# Altium schematic sheet Mosfet Driver.SchDoc
size A
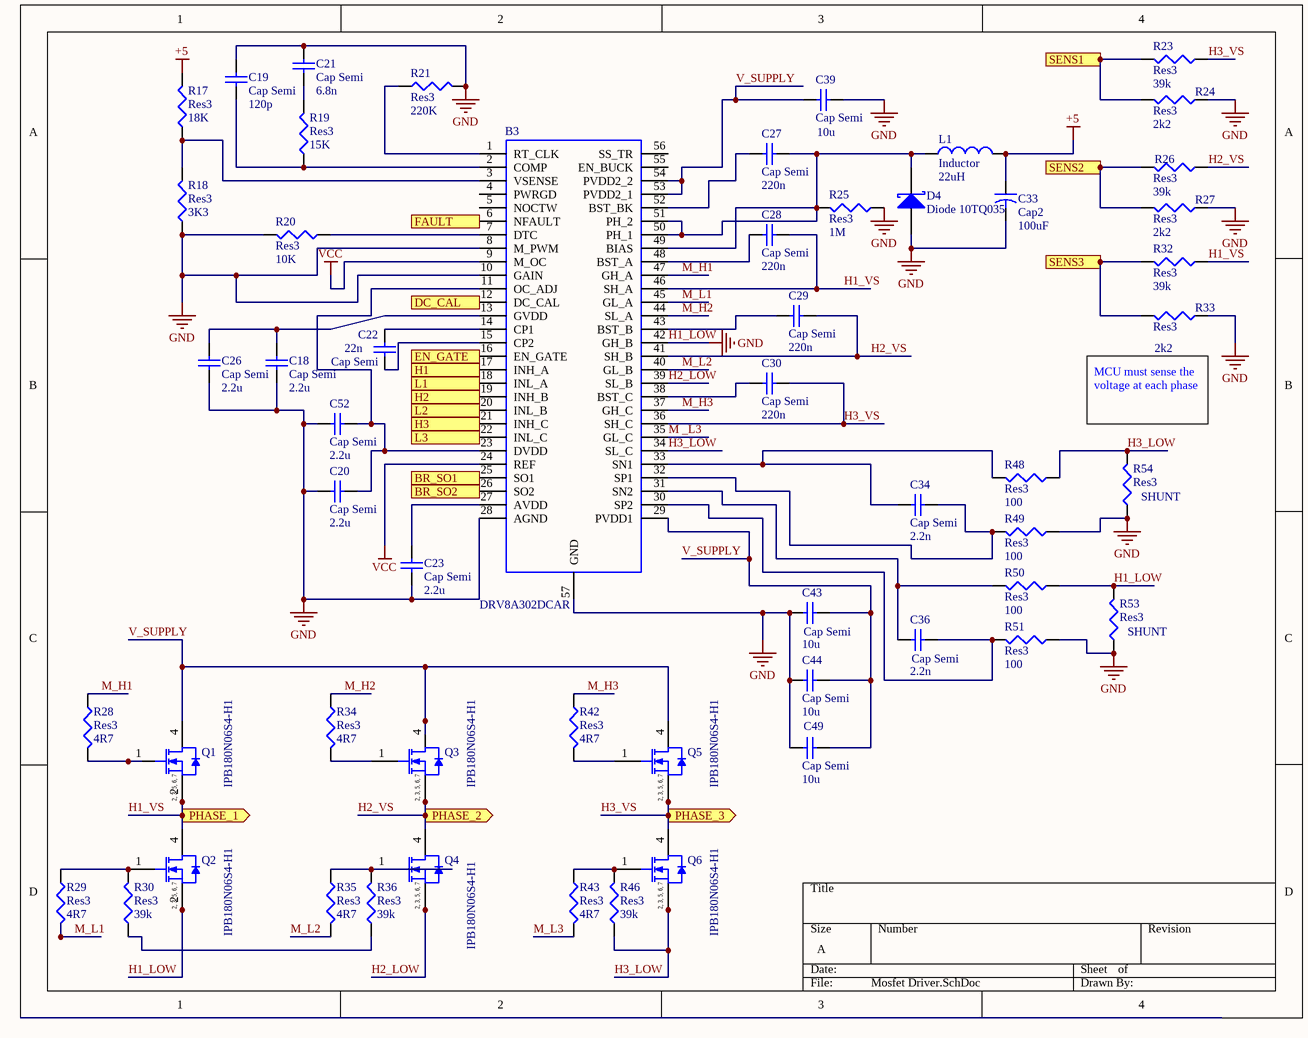
[diagram p0: Mosfet Driver.SchDoc]

## Parts
B3  DRV8A302DCAR  [SOP50P810X120-57N]
C18  Cap Semi  value 2.2u  [1608[0603]]
C19  Cap Semi  value 120p  [1608[0603]]
C20  Cap Semi  value 2.2u  [1608[0603]]
C21  Cap Semi  value 6.8n  [1608[0603]]
C22  Cap Semi  value 22n  [1608[0603]]
C23  Cap Semi  value 2.2u  [1608[0603]]
C26  Cap Semi  value 2.2u  [1608[0603]]
C27  Cap Semi  value 220n  [1608[0603]]
C28  Cap Semi  value 220n  [1608[0603]]
C29  Cap Semi  value 220n  [1608[0603]]
C30  Cap Semi  value 220n  [1608[0603]]
C33  Cap2  value 100uF  [CAPR5-4X5]
C34  Cap Semi  value 2.2n  [1608[0603]]
C36  Cap Semi  value 2.2n  [1608[0603]]
C39  Cap Semi  value 10u  [1608[0603]]
C43  Cap Semi  value 10u  [1608[0603]]
C44  Cap Semi  value 10u  [1608[0603]]
C49  Cap Semi  value 10u  [1608[0603]]
C52  Cap Semi  value 2.2u  [1608[0603]]
D4  Diode 10TQ035  [TO-220AC]
L1  Inductor  value 22uH  [0402-A]
Q1  IPB180N06S4-H1  [INF-PG-TO263-7-3_N]
Q2  IPB180N06S4-H1  [INF-PG-TO263-7-3_N]
Q3  IPB180N06S4-H1  [INF-PG-TO263-7-3_N]
Q4  IPB180N06S4-H1  [INF-PG-TO263-7-3_N]
Q5  IPB180N06S4-H1  [INF-PG-TO263-7-3_N]
Q6  IPB180N06S4-H1  [INF-PG-TO263-7-3_N]
R17  Res3  value 18K  [J1-0603]
R18  Res3  value 3K3  [J1-0603]
R19  Res3  value 15K  [J1-0603]
R20  Res3  value 10K  [J1-0603]
R21  Res3  value 220K  [J1-0603]
R23  Res3  value 39k  [J1-0603]
R24  Res3  value 2k2  [J1-0603]
R25  Res3  value 1M  [J1-0603]
R26  Res3  value 39k  [J1-0603]
R27  Res3  value 2k2  [J1-0603]
R28  Res3  value 4R7  [J1-0603]
R29  Res3  value 4R7  [J1-0603]
R30  Res3  value 39k  [J1-0603]
R32  Res3  value 39k  [J1-0603]
R33  Res3  value 2k2  [J1-0603]
R34  Res3  value 4R7  [J1-0603]
R35  Res3  value 4R7  [J1-0603]
R36  Res3  value 39k  [J1-0603]
R42  Res3  value 4R7  [J1-0603]
R43  Res3  value 4R7  [J1-0603]
R46  Res3  value 39k  [J1-0603]
R48  Res3  value 100  [J1-0603]
R49  Res3  value 100  [J1-0603]
R50  Res3  value 100  [J1-0603]
R51  Res3  value 100  [J1-0603]
R53  Res3  value SHUNT  [J1-0603]
R54  Res3  value SHUNT  [J1-0603]

## Ports
BR_SO1 (out), BR_SO2 (out), DC_CAL (in), EN_GATE (in), FAULT (out), H1 (in), H2 (in), H3 (in), L1 (in), L2 (in), L3 (in), PHASE_1 (out), PHASE_2 (out), PHASE_3 (out), SENS1 (out), SENS2 (out), SENS3 (out)

## Nets
+5: C33.1 L1.2 R17.2
H1_LOW: B3.8(M_PWM) B3.10(GAIN) B3.28(AGND) B3.42(GH_B) B3.57(GND) C18.1 C19.2 C20.2 C21.2 C23.2 C26.1 C33.2 C39.1 C43.2 C44.2 C49.2 C52.2 D4.3(A) Q2.2(SOURCE) Q2.3(SOURCE) Q2.5(SOURCE) Q2.6(SOURCE) Q2.7(SOURCE) R18.1 R20.2 R21.2 R24.1 R25.1 R27.1 R33.1 R49.1 R50.1 R51.1 R53.1 R53.2 R54.1  [also labelled GND]
VCC: B3.9(M_OC) B3.24(REF)
BR_SO1: B3.25(SO1) ; port BR_SO1
BR_SO2: B3.26(SO2) ; port BR_SO2
DC_CAL: B3.12(DC_CAL) ; port DC_CAL
EN_GATE: B3.16(EN_GATE) ; port EN_GATE
FAULT: B3.6(NFAULT) ; port FAULT
H1: B3.17(INH_A) ; port H1
H1_VS: B3.46(SH_A) C28.1 Q1.2(SOURCE) Q1.3(SOURCE) Q1.5(SOURCE) Q1.6(SOURCE) Q1.7(SOURCE) Q2.4(DRAIN) R32.1 ; port PHASE_1
H2: B3.19(INH_B) ; port H2
H2_LOW: B3.39(SL_B) Q4.2(SOURCE) Q4.3(SOURCE) Q4.5(SOURCE) Q4.6(SOURCE) Q4.7(SOURCE)
H2_VS: B3.41(SH_B) C29.1 Q3.2(SOURCE) Q3.3(SOURCE) Q3.5(SOURCE) Q3.6(SOURCE) Q3.7(SOURCE) Q4.4(DRAIN) R26.1 ; port PHASE_2
H3: B3.21(INH_C) ; port H3
H3_LOW: B3.34(SL_C) Q6.2(SOURCE) Q6.3(SOURCE) Q6.5(SOURCE) Q6.6(SOURCE) Q6.7(SOURCE) R46.1 R48.1 R54.2
H3_VS: B3.36(SH_C) C30.1 Q5.2(SOURCE) Q5.3(SOURCE) Q5.5(SOURCE) Q5.6(SOURCE) Q5.7(SOURCE) Q6.4(DRAIN) R23.1 ; port PHASE_3
L1: B3.18(INL_A) ; port L1
L2: B3.20(INL_B) ; port L2
L3: B3.22(INL_C) ; port L3
M _L3: B3.35(GL_C)
M_H1: B3.47(GH_A) R28.1
M_H2: B3.44(SL_A) R34.1
M_H3: B3.37(GH_C) R42.1
M_L1: B3.45(GL_A) R29.2
M_L2: B3.40(GL_B) R35.2
M_L3: R43.2
SENS1: R23.2 R24.2 ; port SENS1
SENS2: R26.2 R27.2 ; port SENS2
SENS3: R32.2 R33.2 ; port SENS3
V_SUPPLY: B3.29(PVDD1) B3.53(PVDD2_1) B3.54(PVDD2_2) C39.2 C43.1 C44.1 C49.1 Q1.4(DRAIN) Q3.4(DRAIN) Q5.4(DRAIN)
NetB3_1: B3.1(RT_CLK) R21.1
NetB3_2: B3.2(COMP) C19.1 R19.1
NetB3_3: B3.3(VSENSE) R17.1 R18.2
NetB3_7: B3.7(DTC) R20.1
NetB3_11: B3.11(OC_ADJ) B3.23(DVDD) C20.1 C52.1
NetB3_13: B3.13(GVDD) C18.2 C26.2
NetB3_14: B3.14(CP1) C22.1
NetB3_15: B3.15(CP2) C22.2
NetB3_27: B3.27(AVDD) C23.1
NetB3_30: B3.30(SP2) C36.1 R51.2
NetB3_31: B3.31(SN2) C36.2 R50.2
NetB3_32: B3.32(SP1) C34.1 R49.2
NetB3_33: B3.33(SN1) C34.2 R48.2
NetB3_38: B3.38(BST_C) C30.2
NetB3_43: B3.43(BST_B) C29.2
NetB3_48: B3.48(BST_A) C28.2
NetB3_49: B3.49(BIAS) B3.50(PH_1) B3.51(PH_2) C27.1 D4.1(K) L1.1 R25.2
NetB3_52: B3.52(BST_BK) C27.2
NetC21_1: C21.1 R19.2
NetQ1_1: Q1.1(GATE) R28.2
NetQ2_1: Q2.1(GATE) R29.1 R30.2
NetQ3_1: Q3.1(GATE) R34.2
NetQ4_1: Q4.1(GATE) R35.1 R36.2
NetQ5_1: Q5.1(GATE) R42.2
NetQ6_1: Q6.1(GATE) R43.1 R46.2
NetR30_1: R30.1 R36.1

Not connected (* = marked no-connect by the designer): B3 4(PWRGD) 5(NOCTW) 55(EN_BUCK) 56(SS_TR)

## Notes on the sheet
- MCU must sense the voltage at each phase
- (in symbol IPB180N06S4-H1) 2, 3, 5, 6, 7

## Library data of the parts
B3 = DRV8302DCAR: 3-Phase Brushless Motor Pre-Driver with Dual Current Sense Amps and Buck Converter (PWM Ctrl); Manufacturer_Name: Texas Instruments; Geometry.Height: 1.2mm; Manufacturer_Part_Number: DRV8302DCAR; RS Part Number: *; RS Price/Stock: *; Arrow Part Number: DRV8302DCAR; Arrow Price/Stock: https://www.arrow.com/en/products/drv8302dcar/texas-instruments; Datasheet Link: http://www.ti.com/lit/gpn/drv8302
C18-C23 C26-C30 C34 C36 C39 C43 C44 C49 C52 = Cap Semi: Capacitor (Semiconductor SIM Model); Published: 8-Jun-2000; LatestRevisionDate: 29-May-2009; LatestRevisionNote: IPC-7351 Footprint Added.; PackageReference: C1206; Publisher: Altium Limited; PackageDescription: Chip Capacitor
C33 = Cap2: Capacitor; Published: 23-Sep-2002; PackageReference: CAPR5-4X5; Publisher: Altium Limited; PackageDescription: Capacitor; 2 Leads
D4 = Diode 10TQ035: Schottky Rectifier; Note: Terminal 2 is the TAB and is electrically connected to the cathode; Published: 8-Jun-2000; LatestRevisionDate: 17-Jul-2002; LatestRevisionNote: Re-released for DXP Platform.; DatasheetVersion: PD-2.057B; PackageVersion: Feb-1998; PackageReference: TO-220AC; Publisher: Altium Limited; PackageDescription: TO, Thru-Hole, Vertical, Heatsink Mounted; 3 In-Line Leads (1 Absent); Pitch 2.54 mm; ComponentLink1Description: Manufacturer Link; ComponentLink1URL: http://www.irf.com/; ComponentLink2Description: Datasheet; ComponentLink2URL: http://www.irf.com/product-info/datasheets/data/10tq.pdf
L1 = Inductor: Code_IEC: 1005; Published: 8-Jun-2000; LatestRevisionDate: 29-May-2009; LatestRevisionNote: IPC-7351 Footprint Added.; PackageReference: 0402-A; Publisher: Altium Limited; PackageDescription: Chip Inductor; Code_JEITA: 0402
Q1-Q6 = IPB180N06S4-H1: OptiMOS-T2 Power-Transistor, 60 V VDS, 180 A ID, PG-TO263-7-3, Reel, Green; Manufacturer: Infineon; Green: TRUE; ID (max): 180 A; IDpuls (max): 720 A; Ptot (max): 250 W; QG: 208 nC; RDS (on) (max) (@10V): 1.7 mOhm; RthJC (max): 0.6 K/W; VDS (max): 60 V; VGS(th) (max): 4 V; VGS(th) (min): 2 V; DatasheetVersion: Rev. 1.0; PackageReference: PG-TO263-7-3; PackageDescription: 7-Pin Plastic (Green) Transistor Single Outline Package, 10 x 9.25 mm Body, 1.27 mm Pitch; Supplier 1: Mouser; Supplier Part Number 1: 726-IPB180N06S4-H1; Supplier 2: Digi-Key; Supplier Part Number 2: IPB180N06S4-H1-ND; Halogen-free: TRUE; Packing: Reel; Technology: OptiMOS-T2; Mounting Technology: Surface Mount; PartNumber: IPB180N06S4-H1; ComponentLink1Description: Manufacturer URL; ComponentLink1URL: http://www.infineon.com/; ComponentLink2Description: Datasheet; ComponentLink2URL: http://www.infineon.com/dgdl/IPB180N06S4-H1_DS_10.pdf?folderId=db3a30431ff9881501203cca7672178b&fileId=db3a30431ff9881501203ccc9314178e&location=en.Products.Automotive_ICs.Automotive_MOSFETs.Single__N-Channel_60V_MOSFETs.DATASHEET.IPB180N06S4-H1_DS_10.pdf; ComponentLink3Description: Package Specification; ComponentLink3URL: http://www.infineon.com/cms/packages/SMD_-_Surface_Mounted_Devices/P-PG-TO263/P-TO263-07-02x_-3.html?__locale=en
R17-R21 R23-R30 R32-R36 R42 R43 R46 R48-R51 R53 R54 = Res3: Resistor; Published: 8-Jun-2000; LatestRevisionDate: 29-May-2009; LatestRevisionNote: IPC-7351 Footprint Added.; PackageReference: J1-0603; Publisher: Altium Limited; PackageDescription: Chip Resistor